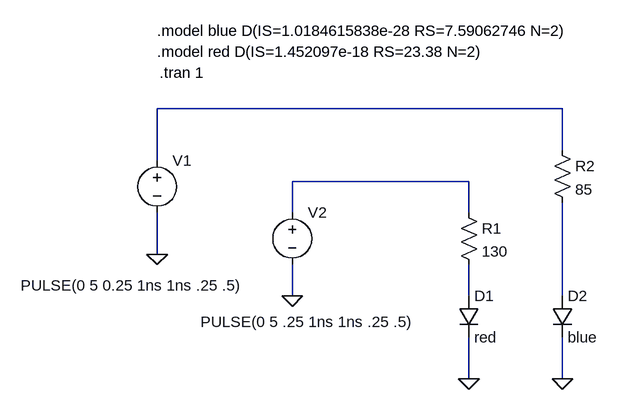
[diagram p0: schematic simulation_lab_3.asc]
simulation_lab_3.asc, the LTspice schematic file:
Version 4
SHEET 1 880 680
WIRE 560 0 -64 0
WIRE 560 64 560 0
WIRE -64 80 -64 0
WIRE 416 112 144 112
WIRE 144 160 144 112
WIRE 416 160 416 112
WIRE -64 224 -64 160
WIRE 144 288 144 240
WIRE 416 288 416 240
WIRE 560 288 560 144
WIRE 416 416 416 352
WIRE 560 416 560 352
FLAG -64 224 0
FLAG 144 288 0
FLAG 416 416 0
FLAG 560 416 0
SYMBOL voltage -64 64 R0
WINDOW 3 -210 208 Left 2
WINDOW 123 0 0 Left 0
WINDOW 39 0 0 Left 0
SYMATTR InstName V1
SYMATTR Value PULSE(0 5 0.25 1ns 1ns .25 .5)
SYMBOL voltage 144 144 R0
WINDOW 3 -141 184 Left 2
WINDOW 123 0 0 Left 0
WINDOW 39 0 0 Left 0
SYMATTR InstName V2
SYMATTR Value PULSE(0 5 .25 1ns 1ns .25 .5)
SYMBOL res 400 144 R0
SYMATTR InstName R1
SYMATTR Value 130
SYMBOL res 544 48 R0
SYMATTR InstName R2
SYMATTR Value 85
SYMBOL diode 400 288 R0
SYMATTR InstName D1
SYMATTR Value red
SYMBOL diode 544 288 R0
SYMATTR InstName D2
SYMATTR Value blue
TEXT -64 -88 Left 2 !.model red D(IS=1.452097e-18 RS=23.38 N=2)
TEXT -64 -120 Left 2 !.model blue D(IS=1.0184615838e-28 RS=7.59062746 N=2)
TEXT -60 -56 Left 2 !.tran 1

The netlist it stands for:
* simulation_lab_3.asc
V1 N001 0 PULSE(0 5 0.25 1ns 1ns .25 .5)
V2 N002 0 PULSE(0 5 .25 1ns 1ns .25 .5)
R1 N002 N003 130
R2 N001 N004 85
D1 N003 0 red
D2 N004 0 blue
.model D D
.lib standard.dio
.model red D(IS=1.452097e-18 RS=23.38 N=2)
.model blue D(IS=1.0184615838e-28 RS=7.59062746 N=2)
.tran 1
.backanno
.end